# Altium schematic sheet 04_UART.SchDoc
size 297 x 209 mm; SheetNumber: 4; SheetTotal: 5; Page Create Date: March  8, 1995; Page Number: 4; Page Size: A4; Reviewer: Default; Page Count: 5; Designer: Dennis; Page Name: 04_UART; RevCode: 1.0; DsnPath: H:\PCB\2026\狼王傻波一\20260204_V0_ELRS-RX\ELRS-RX-MODULE-V11\ELRS-RX-MODULE-V11-20260127.DSN; SchematicName: SCHEMATIC1; PageName: 04_UART; PageSize: A4; TopSchematic: True
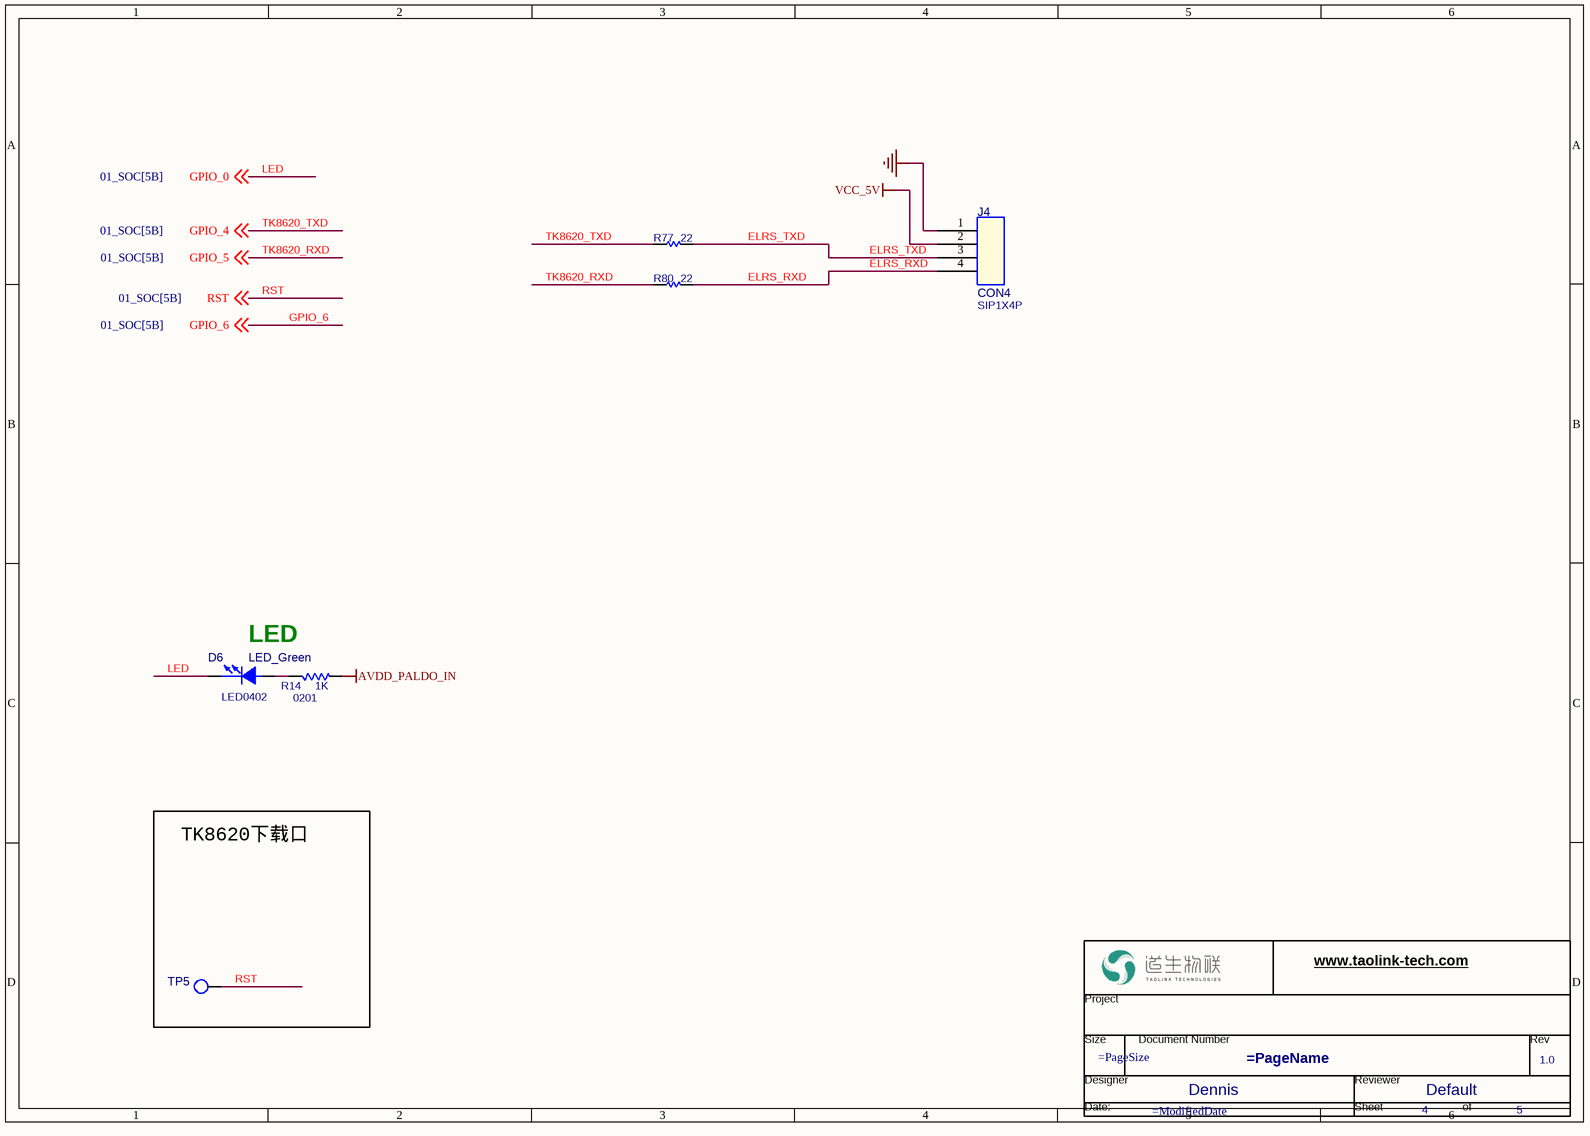
[diagram p0: 04_UART.SchDoc]

## Parts
*  RevCode: 1.0  Designer: Dennis  Reviewer: Default  Page Number: 4  Page Count: 5  (graphical)
D6  LED_Green  [LED0402]
J4  CON4  [SIP1X4P]
R14  1K  [0201]
R77  22  [0201]
R80  22  [0201]
TP5  NC  [TP1_6MM]  (value not drawn)

## Blocks framed on the sheet
TK8620下载口: TP5

## Nets
AVDD_PALDO_IN: R14.2
GND: J4.1
VCC_5V: J4.2
ELRS_RXD: J4.4 R80.2
ELRS_TXD: J4.3 R77.2
LED: D6.2(CATHODE) ; off-sheet GPIO_0  [also labelled GPIO_0]
RST: TP5.1(TP) ; off-sheet RST
TK8620_RXD: R80.1 ; off-sheet GPIO_5  [also labelled GPIO_5]
TK8620_TXD: R77.1 ; off-sheet GPIO_4  [also labelled GPIO_4]
NetD6_1: D6.1(ANODE) R14.1

## Notes on the sheet
- LED
- (in symbol TaoLin_DesignName) www.taolink-tech.com; Project; Size; Document Number; Rev; Designer; Reviewer; Date:; Sheet; of

## Library data of the parts
* = TaoLin_DesignName: Page Create Date: March  8, 1995; Page Size: =PageSize; Page Name: =PageName; Page Modify Date: =ModifiedDate
D6 = MFOE1101_0: Part Reference: D6; Value: LED_Green; PCB Footprint: LED0402
J4 = CON4: Part Reference: J4; Value: CON4; PCB Footprint: SIP1X4P
R14 = R_0: Part Reference: R14; Value: 1K; PCB Footprint: 0201
R77 = RES: Part Reference: R77; FPLIST: 0402R_S,0402R,0402R_M,0402R_MIN,R0402; 存货编码: 040101199; 存货名称: 贴片电阻; 规格: 贴装碳膜电阻器－110KR－±1%－1/16W－0402; 型号: 110K 1%; 存货简称: TURBO; Value: 22; PCB Footprint: 0201
R80 = RES: Part Reference: R80; 存货简称: TURBO; 型号: 110K 1%; 规格: 贴装碳膜电阻器－110KR－±1%－1/16W－0402; 存货名称: 贴片电阻; 存货编码: 040101199; FPLIST: 0402R_S,0402R,0402R_M,0402R_MIN,R0402; Value: 22; PCB Footprint: 0201
TP5 = T POINT R: Part Reference: TP5; Value: NC; PCB Footprint: TP1_6MM